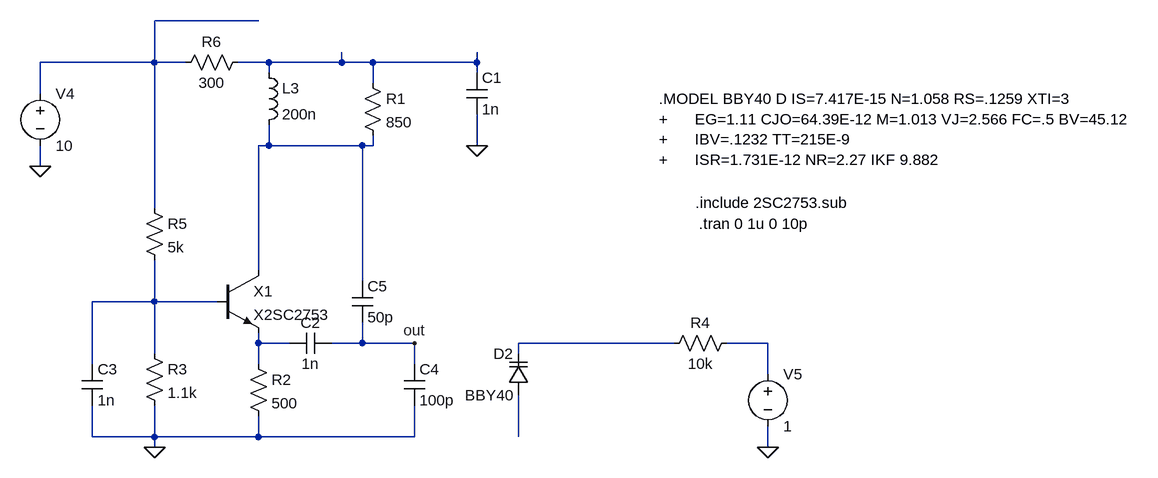
[diagram p0: schematic temp.asc]
temp.asc, the LTspice schematic file:
Version 4
SHEET 1 1772 1268
WIRE 368 336 208 336
WIRE 208 400 208 336
WIRE 208 400 32 400
WIRE 256 400 208 400
WIRE 384 400 336 400
WIRE 496 400 496 384
WIRE 496 400 384 400
WIRE 544 400 496 400
WIRE 704 400 704 384
WIRE 704 400 544 400
WIRE 384 416 384 400
WIRE 704 416 704 400
WIRE 544 432 544 400
WIRE 32 448 32 400
WIRE 384 528 384 496
WIRE 384 528 368 528
WIRE 528 528 384 528
WIRE 544 528 544 512
WIRE 544 528 528 528
WIRE 704 528 704 480
WIRE 32 560 32 528
WIRE 208 624 208 400
WIRE 368 720 368 528
WIRE 528 736 528 528
WIRE 208 768 208 704
WIRE 208 768 112 768
WIRE 304 768 208 768
WIRE 368 832 368 816
WIRE 416 832 368 832
WIRE 528 832 528 800
WIRE 528 832 480 832
WIRE 608 832 528 832
WIRE 1008 832 768 832
WIRE 1152 832 1088 832
WIRE 208 848 208 768
WIRE 768 848 768 832
WIRE 112 864 112 768
WIRE 368 864 368 832
WIRE 608 864 608 832
WIRE 1152 880 1152 832
WIRE 112 976 112 928
WIRE 208 976 208 928
WIRE 208 976 112 976
WIRE 368 976 368 944
WIRE 368 976 208 976
WIRE 608 976 608 928
WIRE 608 976 368 976
WIRE 768 976 768 912
WIRE 208 992 208 976
WIRE 1152 992 1152 960
FLAG 208 992 0
FLAG 32 560 0
FLAG 1152 992 0
FLAG 608 832 out
FLAG 704 528 0
SYMBOL npn 304 720 R0
SYMATTR InstName X1
SYMATTR Value X2SC2753
SYMATTR Prefix X
SYMBOL cap 592 864 R0
SYMATTR InstName C4
SYMATTR Value 100p
SYMBOL ind 368 400 R0
SYMATTR InstName L3
SYMATTR Value 200n
SYMBOL voltage 32 432 R0
WINDOW 123 0 0 Left 0
WINDOW 39 0 0 Left 0
SYMATTR InstName V4
SYMATTR Value 10
SYMBOL res 1104 816 R90
WINDOW 0 0 56 VBottom 2
WINDOW 3 32 56 VTop 2
SYMATTR InstName R4
SYMATTR Value 10k
SYMBOL voltage 1152 864 R0
WINDOW 123 0 0 Left 0
WINDOW 39 0 0 Left 0
SYMATTR InstName V5
SYMATTR Value 1
SYMBOL cap 512 736 R0
SYMATTR InstName C5
SYMATTR Value 50p
SYMBOL varactor 784 912 R180
WINDOW 0 24 64 Left 2
WINDOW 3 24 0 Left 2
SYMATTR InstName D2
SYMATTR Value BBY40
SYMBOL res 528 416 R0
SYMATTR InstName R1
SYMATTR Value 850
SYMBOL res 352 848 R0
SYMATTR InstName R2
SYMATTR Value 500
SYMBOL res 192 832 R0
SYMATTR InstName R3
SYMATTR Value 1.1k
SYMBOL res 192 608 R0
SYMATTR InstName R5
SYMATTR Value 5k
SYMBOL cap 480 816 R90
WINDOW 0 0 32 VBottom 2
WINDOW 3 32 32 VTop 2
SYMATTR InstName C2
SYMATTR Value 1n
SYMBOL res 352 384 R90
WINDOW 0 0 56 VBottom 2
WINDOW 3 32 56 VTop 2
SYMATTR InstName R6
SYMATTR Value 300
SYMBOL cap 688 416 R0
SYMATTR InstName C1
SYMATTR Value 1n
SYMBOL cap 96 864 R0
SYMATTR InstName C3
SYMATTR Value 1n
TEXT 1040 616 Left 2 !.include 2SC2753.sub
TEXT 1046 648 Left 2 !.tran 0 1u 0 10p
TEXT 984 456 Left 2 !.MODEL BBY40 D IS=7.417E-15 N=1.058 RS=.1259 XTI=3 \n+      EG=1.11 CJO=64.39E-12 M=1.013 VJ=2.566 FC=.5 BV=45.12 \n+      IBV=.1232 TT=215E-9\n+      ISR=1.731E-12 NR=2.27 IKF 9.882

The netlist it stands for:
* temp.asc
XX1 N003 N004 N005 X2SC2753  ; pins C B E
C4 out 0 100p
L3 N002 N003 200n
V4 N001 0 10
R4 N007 N006 10k
V5 N007 0 1
C5 N003 out 50p
D2 N008 N006 BBY40
R1 N002 N003 850
R2 N005 0 500
R3 N004 0 1.1k
R5 N001 N004 5k
C2 out N005 1n
R6 N002 N001 300
C1 N002 0 1n
C3 N004 0 1n
.model D D
.lib standard.dio
.include 2SC2753.sub
.tran 0 1u 0 10p
.MODEL BBY40 D IS=7.417E-15 N=1.058 RS=.1259 XTI=3
+      EG=1.11 CJO=64.39E-12 M=1.013 VJ=2.566 FC=.5 BV=45.12
+      IBV=.1232 TT=215E-9
+      ISR=1.731E-12 NR=2.27 IKF 9.882
.backanno
.end